# Altium schematic sheet 3d_dsn_approx - Copy.SchDoc
size A1; SheetNumber: 1; SheetTotal: 13
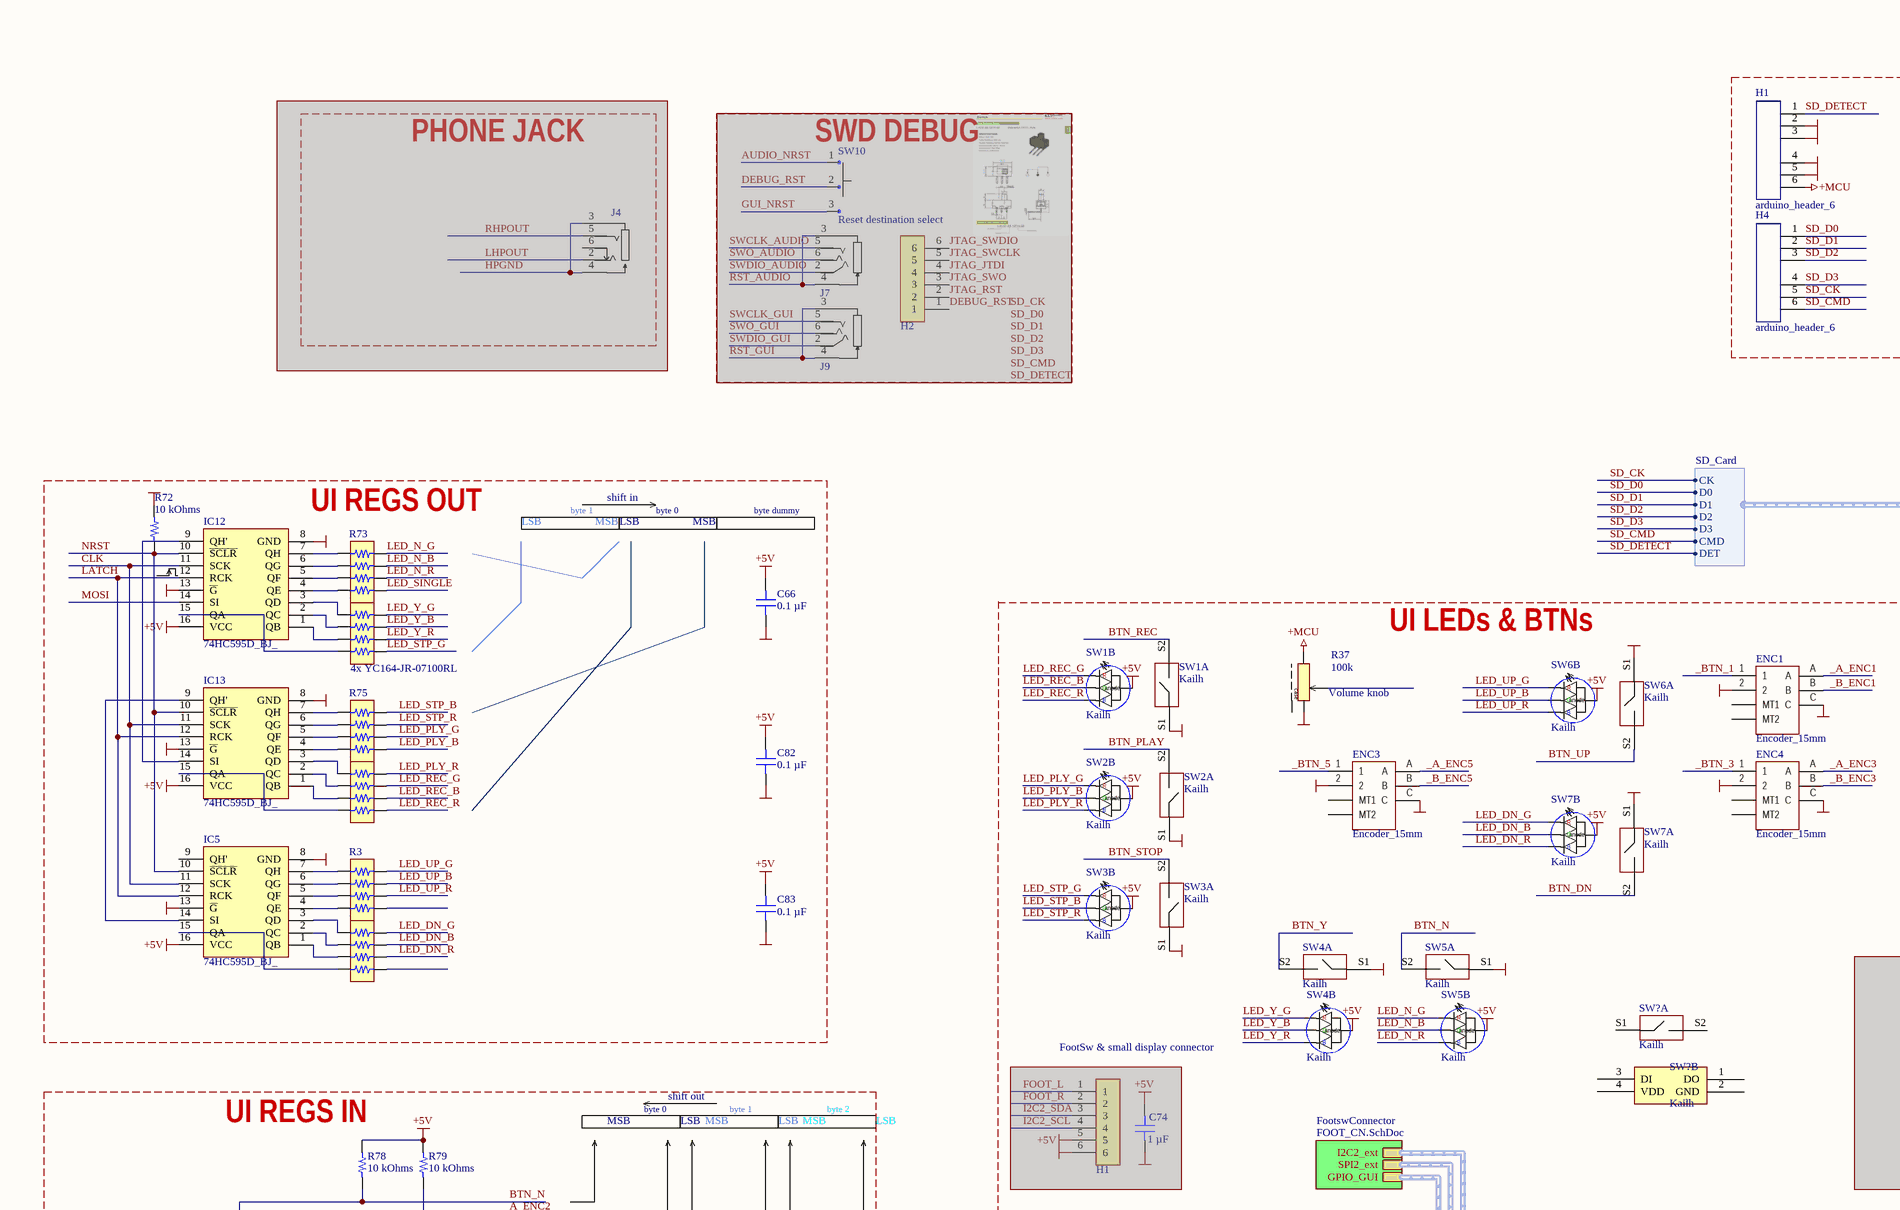
[diagram p0: 3d_dsn_approx - Copy.SchDoc, top left]
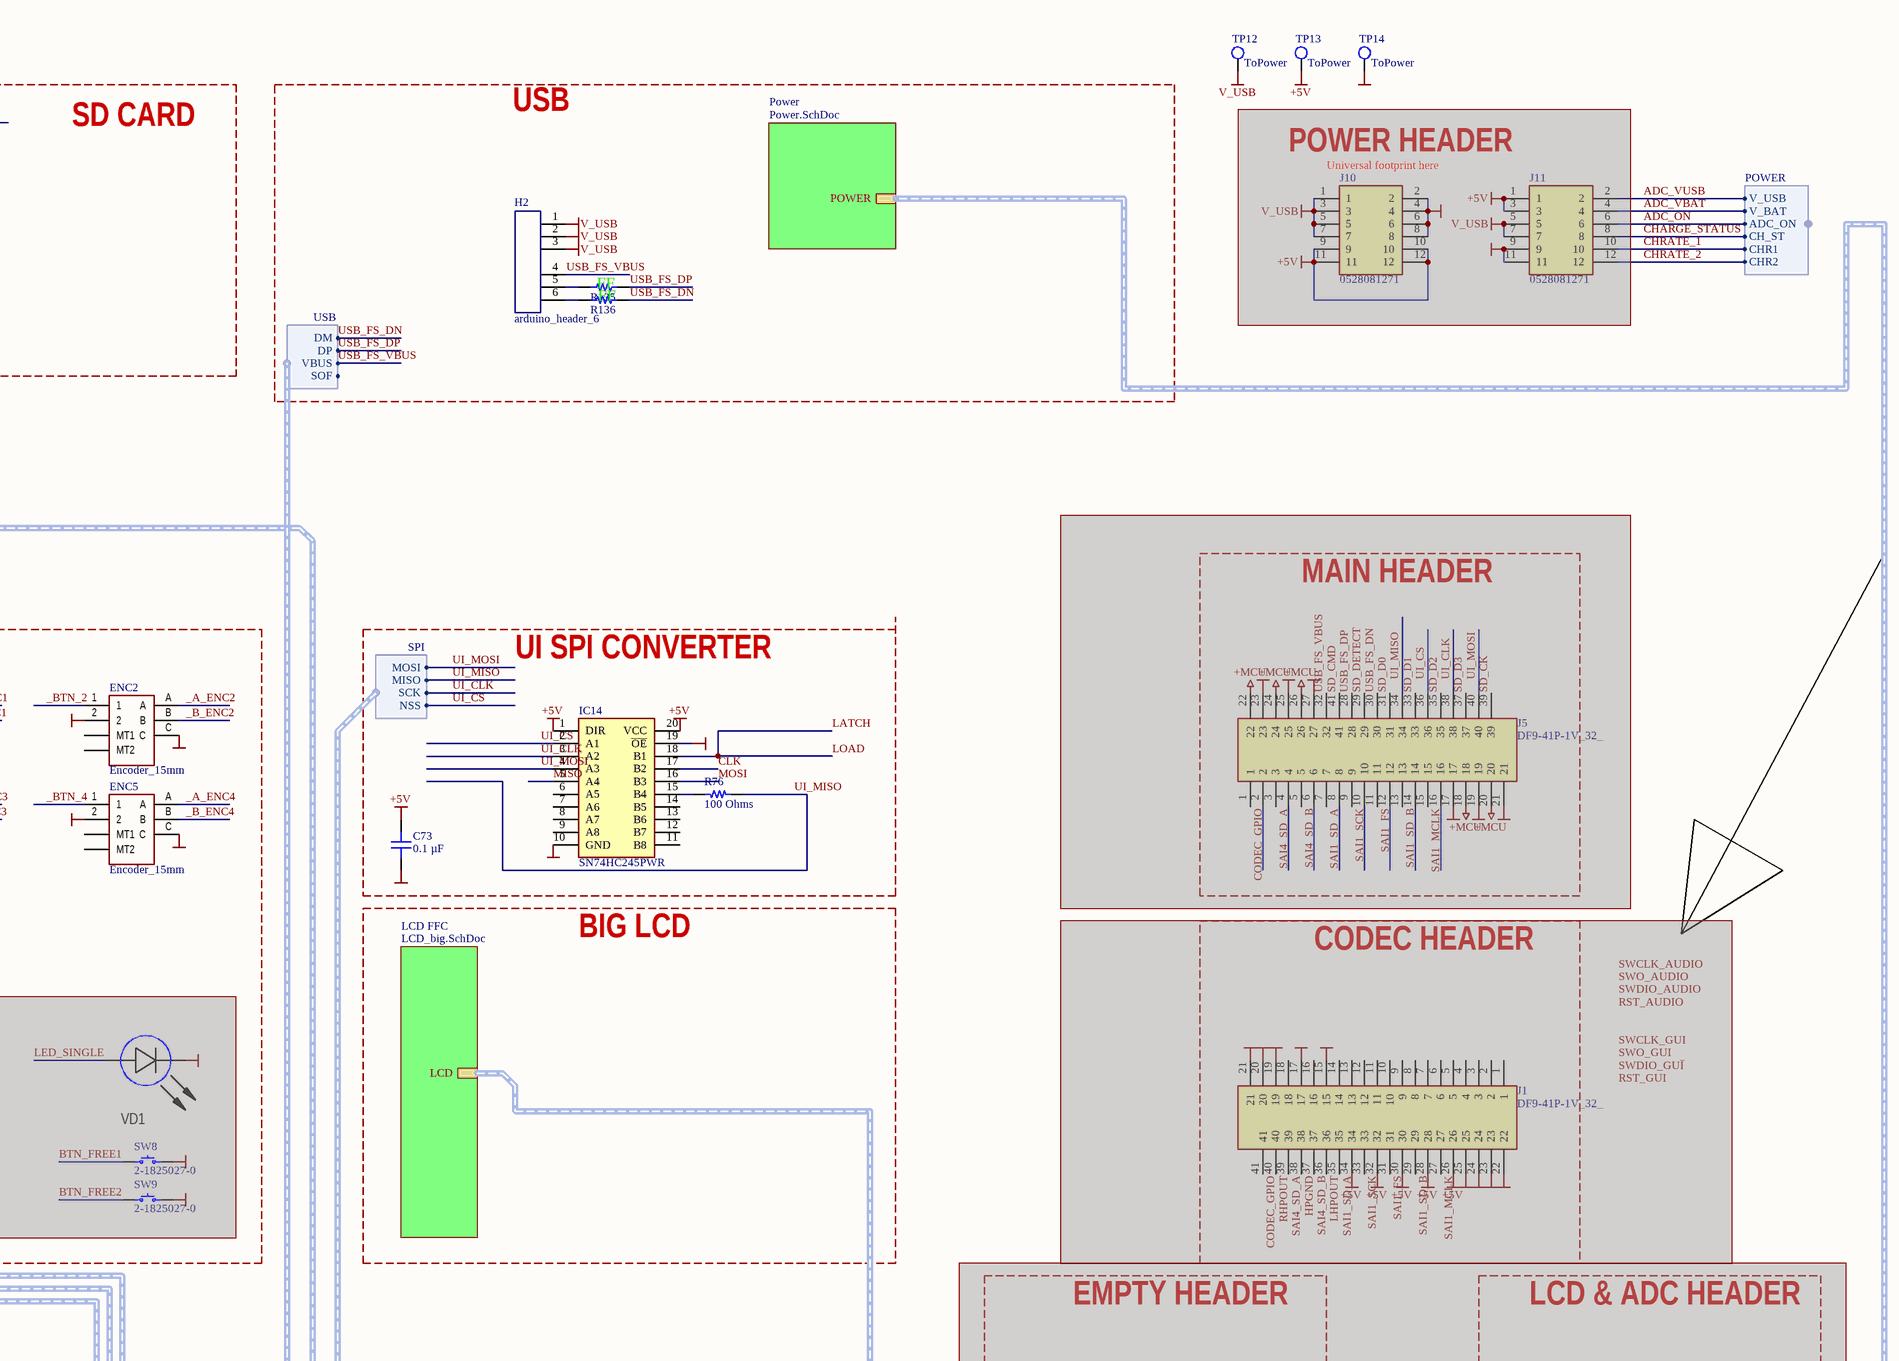
[diagram p1: 3d_dsn_approx - Copy.SchDoc, top right]
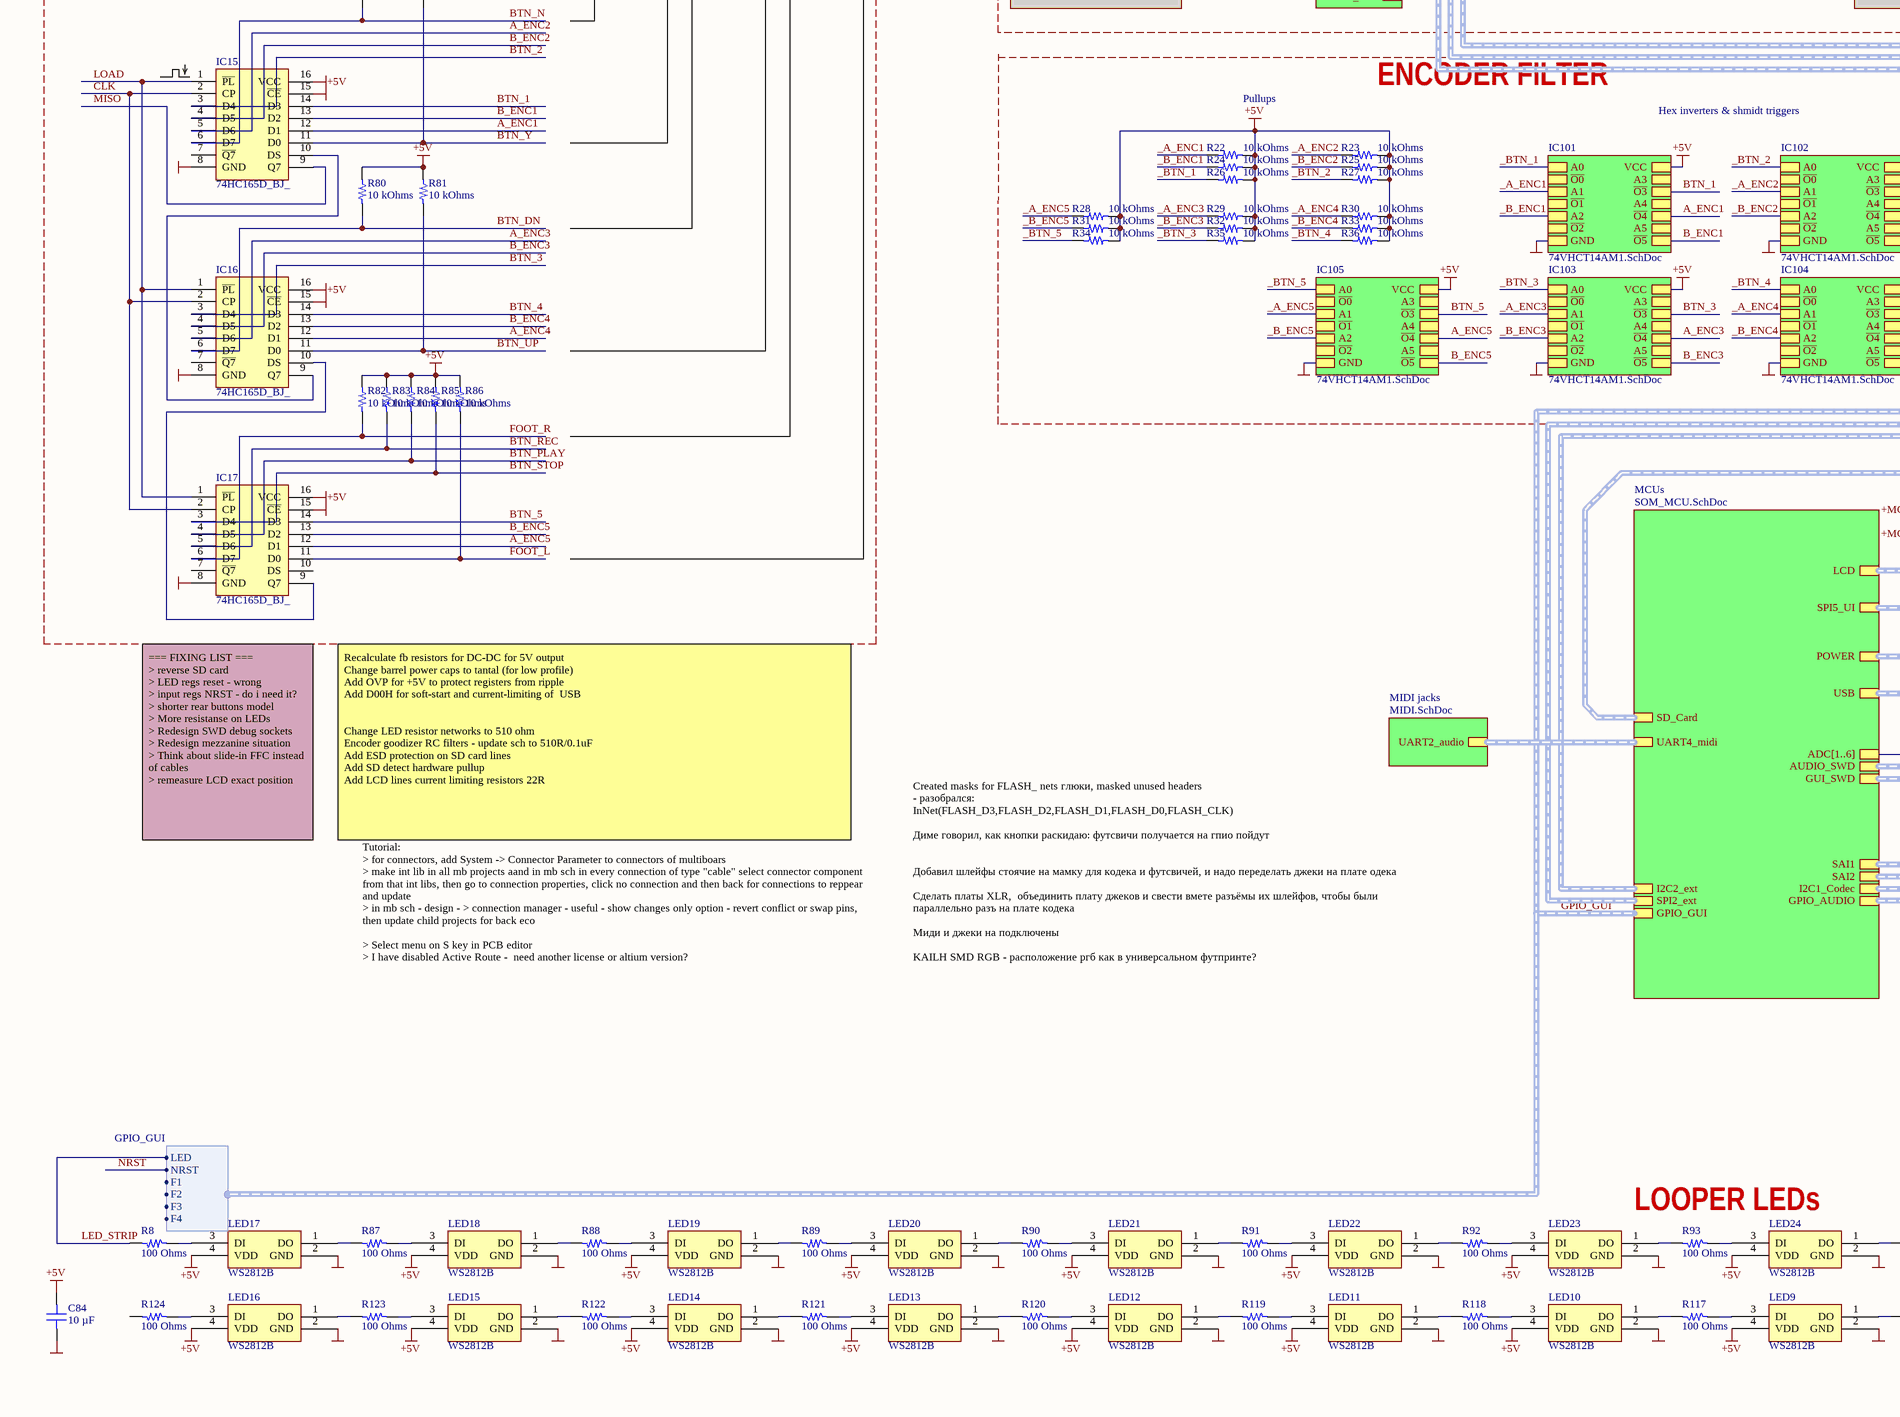
[diagram p2: 3d_dsn_approx - Copy.SchDoc, bottom left]
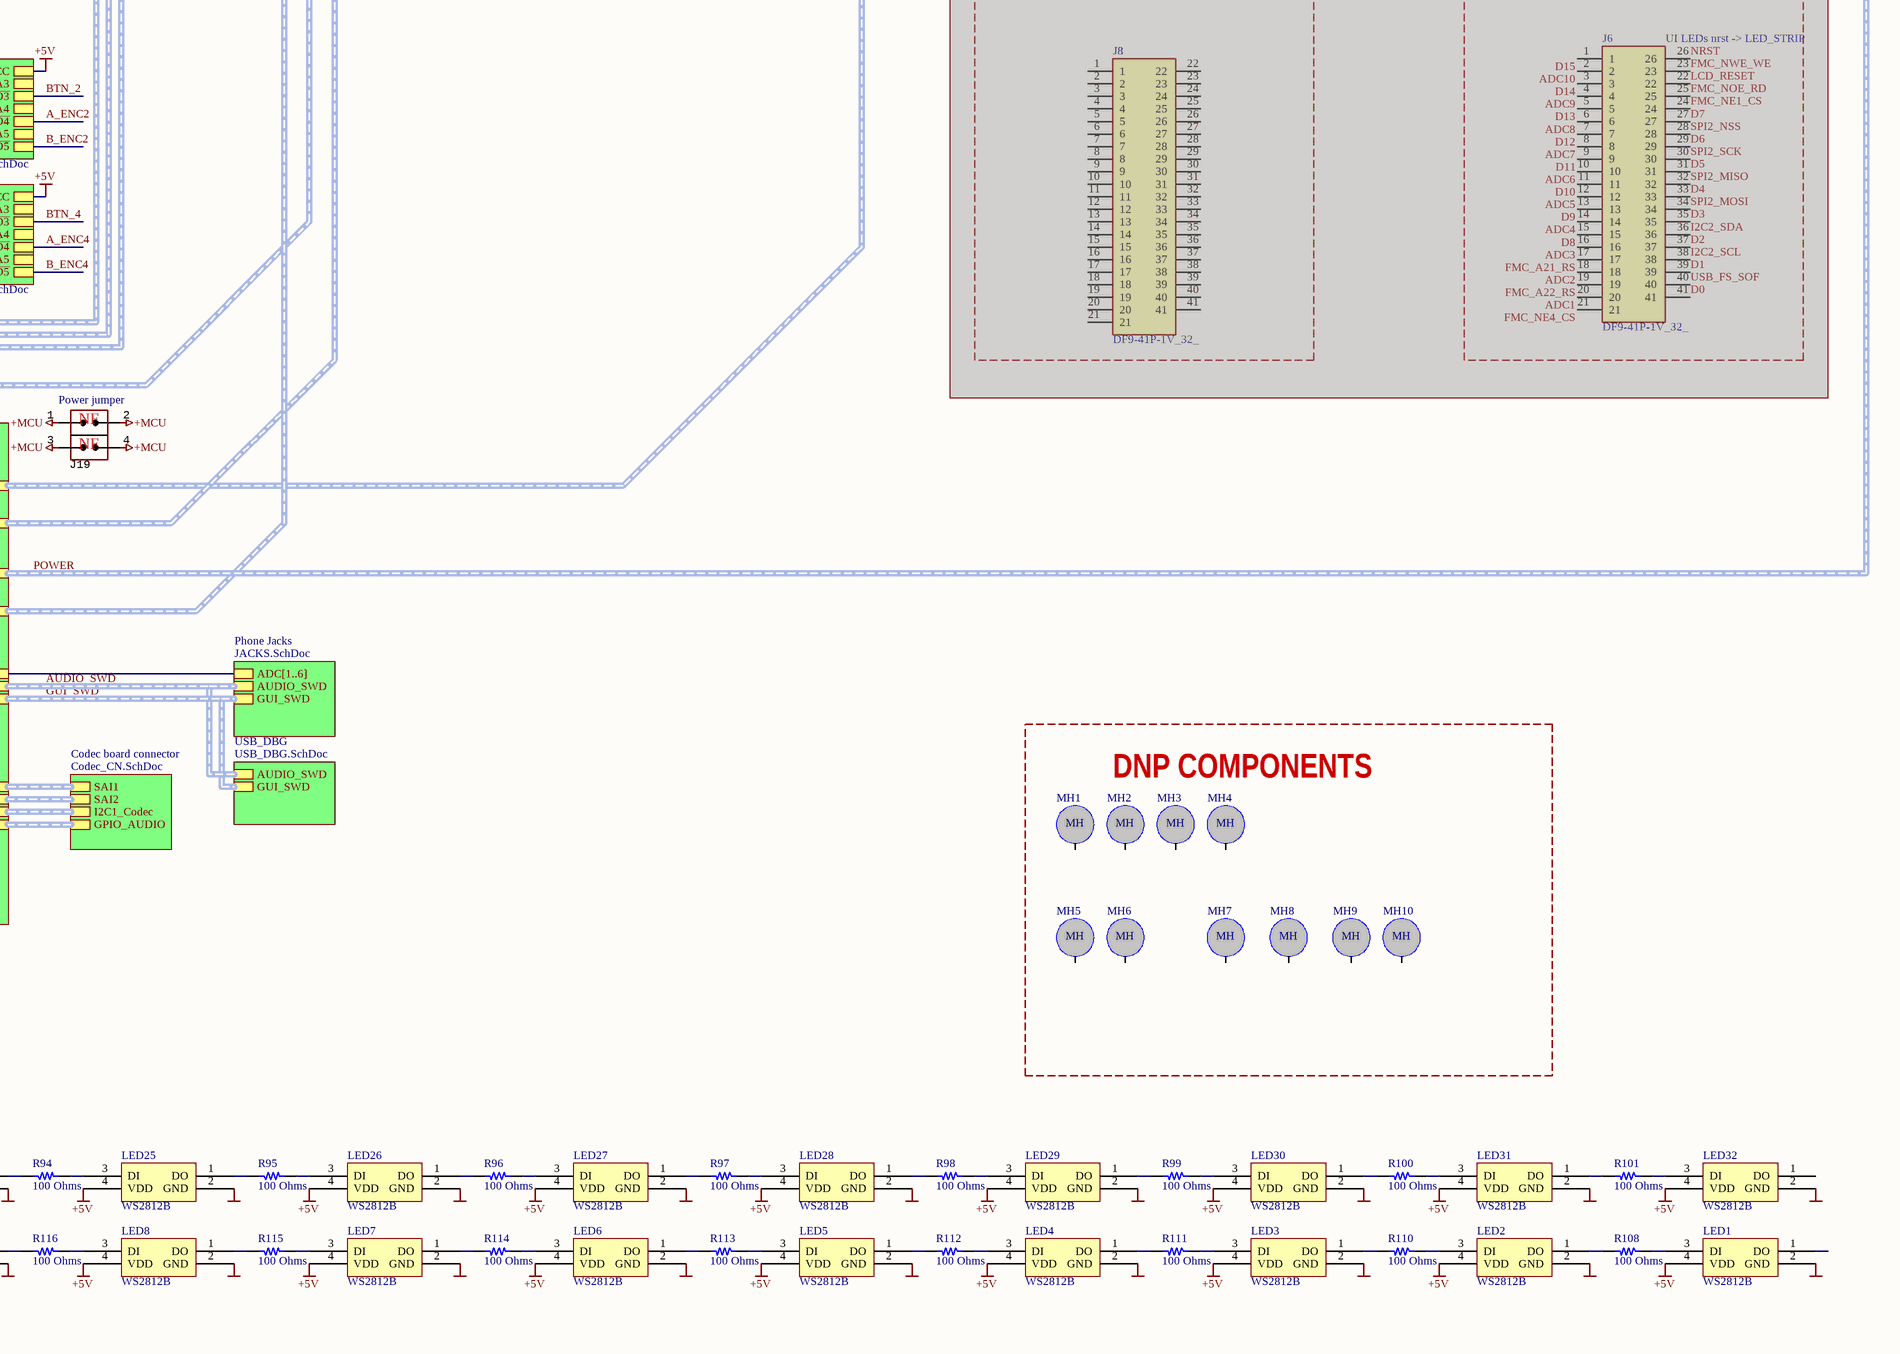
[diagram p3: 3d_dsn_approx - Copy.SchDoc, bottom right]

## Parts
(Parts that share a designator on the sheet are numbered #1, #2 ... from top to bottom, then left to right.)
C66  0.1 µF  [CAP 0603_1608]
C73  0.1 µF  [CAP 0603_1608]
C74  1 µF  [CAP 0805_2012]  (masked out: inside a compile mask, not in the netlist)
C82  0.1 µF  [CAP 0603_1608]
C83  0.1 µF  [CAP 0603_1608]
C84  10 µF  [CAP 0805_2012]
ENC1  Encoder_15mm  [EC11_15mm]
ENC2  Encoder_15mm  [EC11_15mm]
ENC3  Encoder_15mm  [EC11_15mm]
ENC4  Encoder_15mm  [EC11_15mm]
ENC5  Encoder_15mm  [EC11_15mm]
H1#1  arduino_header_6  [header-6_female]
H1#2  1.5-6A  [1.5-6A]  (value not drawn)  (masked out: inside a compile mask, not in the netlist)
H2#1  arduino_header_6  [header-6_female]
H2#2  1.5-6A  [1.5-6A]  (value not drawn)  (masked out: inside a compile mask, not in the netlist)
H4  arduino_header_6  [header-6_female]
IC5  74HC595D_BJ_  [SOIC127P600X175-16N]
IC12  74HC595D_BJ_  [SOIC127P600X175-16N]
IC13  74HC595D_BJ_  [SOIC127P600X175-16N]
IC14  SN74HC245PWR  [SOP65P640X120-20N]
IC15  74HC165D_BJ_  [SOIC127P600X175-16N]
IC16  74HC165D_BJ_  [SOIC127P600X175-16N]
IC17  74HC165D_BJ_  [SOIC127P600X175-16N]
J1  DF9-41P-1V_32_  [HIROSE_DF9-41P-1V(32)]  (masked out: inside a compile mask, not in the netlist)
J4  35RASMT2BHNTRX  [PJ_327]  (value not drawn)  (masked out: inside a compile mask, not in the netlist)
J5  DF9-41P-1V_32_  [HIROSE_DF9-41P-1V(32)]  (masked out: inside a compile mask, not in the netlist)
J6  DF9-41P-1V_32_  [HIROSE_DF9-41P-1V(32)]  (masked out: inside a compile mask, not in the netlist)
J7  PJ-327F  [PJ-327F]  (value not drawn)  (masked out: inside a compile mask, not in the netlist)
J8  DF9-41P-1V_32_  [HIROSE_DF9-41P-1V(32)]  (masked out: inside a compile mask, not in the netlist)
J9  PJ-327F  [PJ-327F]  (value not drawn)  (masked out: inside a compile mask, not in the netlist)
J10  0528081271  [AFA11-S12GLA-00]  (masked out: inside a compile mask, not in the netlist)
J11  0528081271  [AFA11-S12GLA-00]  (masked out: inside a compile mask, not in the netlist)
J19  (no value)  [CON: JUMPER x2]
LED1  WS2812B  [WS2812B_2.2x2mm]
LED2  WS2812B  [WS2812B_2.2x2mm]
LED3  WS2812B  [WS2812B_2.2x2mm]
LED4  WS2812B  [WS2812B_2.2x2mm]
LED5  WS2812B  [WS2812B_2.2x2mm]
LED6  WS2812B  [WS2812B_2.2x2mm]
LED7  WS2812B  [WS2812B_2.2x2mm]
LED8  WS2812B  [WS2812B_2.2x2mm]
LED9  WS2812B  [WS2812B_2.2x2mm]
LED10  WS2812B  [WS2812B_2.2x2mm]
LED11  WS2812B  [WS2812B_2.2x2mm]
LED12  WS2812B  [WS2812B_2.2x2mm]
LED13  WS2812B  [WS2812B_2.2x2mm]
LED14  WS2812B  [WS2812B_2.2x2mm]
LED15  WS2812B  [WS2812B_2.2x2mm]
LED16  WS2812B  [WS2812B_2.2x2mm]
LED17  WS2812B  [WS2812B_2.2x2mm]
LED18  WS2812B  [WS2812B_2.2x2mm]
LED19  WS2812B  [WS2812B_2.2x2mm]
LED20  WS2812B  [WS2812B_2.2x2mm]
LED21  WS2812B  [WS2812B_2.2x2mm]
LED22  WS2812B  [WS2812B_2.2x2mm]
LED23  WS2812B  [WS2812B_2.2x2mm]
LED24  WS2812B  [WS2812B_2.2x2mm]
LED25  WS2812B  [WS2812B_2.2x2mm]
LED26  WS2812B  [WS2812B_2.2x2mm]
LED27  WS2812B  [WS2812B_2.2x2mm]
LED28  WS2812B  [WS2812B_2.2x2mm]
LED29  WS2812B  [WS2812B_2.2x2mm]
LED30  WS2812B  [WS2812B_2.2x2mm]
LED31  WS2812B  [WS2812B_2.2x2mm]
LED32  WS2812B  [WS2812B_2.2x2mm]
MH1  MountingHole  [Hole_2.5mm]  (value not drawn)
MH2  MountingHole  [Hole_2.5mm]  (value not drawn)
MH3  MountingHole  [Hole_2.5mm]  (value not drawn)
MH4  MountingHole  [Hole_2.5mm]  (value not drawn)
MH5  MountingHole  [Hole_2.5mm]  (value not drawn)
MH6  MountingHole  [Hole_2.5mm]  (value not drawn)
MH7  MountingHole  [Hole_2.5mm]  (value not drawn)
MH8  MountingHole  [Hole_2.5mm]  (value not drawn)
MH9  MountingHole  [Hole_2.5mm]  (value not drawn)
MH10  MountingHole  [Hole_2.5mm]  (value not drawn)
R3  YC164-JR-07100RL  [RESNET 1206-8 CONVEX]  (value not drawn)
R4  YC164-JR-07100RL  [RESNET 1206-8 CONVEX]  (value not drawn)
R8  100 Ohms  [RES 0402_1005]
R22  10 kOhms  [RES 0603_1608]
R23  10 kOhms  [RES 0603_1608]
R24  10 kOhms  [RES 0603_1608]
R25  10 kOhms  [RES 0603_1608]
R26  10 kOhms  [RES 0603_1608]
R27  10 kOhms  [RES 0603_1608]
R28  10 kOhms  [RES 0603_1608]
R29  10 kOhms  [RES 0603_1608]
R30  10 kOhms  [RES 0603_1608]
R31  10 kOhms  [RES 0603_1608]
R32  10 kOhms  [RES 0603_1608]
R33  10 kOhms  [RES 0603_1608]
R34  10 kOhms  [RES 0603_1608]
R35  10 kOhms  [RES 0603_1608]
R36  10 kOhms  [RES 0603_1608]
R37  100k  [POT]
R72  10 kOhms  [RES 0603_1608]
R73  YC164-JR-07100RL  [RESNET 1206-8 CONVEX]  (value not drawn)
R74  YC164-JR-07100RL  [RESNET 1206-8 CONVEX]  (value not drawn)
R75  YC164-JR-07100RL  [RESNET 1206-8 CONVEX]  (value not drawn)
R76  100 Ohms  [RES 0402_1005]
R77  YC164-JR-07100RL  [RESNET 1206-8 CONVEX]  (value not drawn)
R78  10 kOhms  [RES 0603_1608]
R79  10 kOhms  [RES 0603_1608]
R80  10 kOhms  [RES 0603_1608]
R81  10 kOhms  [RES 0603_1608]
R82  10 kOhms  [RES 0603_1608]
R83  10 kOhms  [RES 0603_1608]
R84  10 kOhms  [RES 0603_1608]
R85  10 kOhms  [RES 0603_1608]
R86  10 kOhms  [RES 0603_1608]
R87  100 Ohms  [RES 0402_1005]
R88  100 Ohms  [RES 0402_1005]
R89  100 Ohms  [RES 0402_1005]
R90  100 Ohms  [RES 0402_1005]
R91  100 Ohms  [RES 0402_1005]
R92  100 Ohms  [RES 0402_1005]
R93  100 Ohms  [RES 0402_1005]
R94  100 Ohms  [RES 0402_1005]
R95  100 Ohms  [RES 0402_1005]
R96  100 Ohms  [RES 0402_1005]
R97  100 Ohms  [RES 0402_1005]
R98  100 Ohms  [RES 0402_1005]
R99  100 Ohms  [RES 0402_1005]
R100  100 Ohms  [RES 0402_1005]
R101  100 Ohms  [RES 0402_1005]
R108  100 Ohms  [RES 0402_1005]
R110  100 Ohms  [RES 0402_1005]
R111  100 Ohms  [RES 0402_1005]
R112  100 Ohms  [RES 0402_1005]
R113  100 Ohms  [RES 0402_1005]
R114  100 Ohms  [RES 0402_1005]
R115  100 Ohms  [RES 0402_1005]
R116  100 Ohms  [RES 0402_1005]
R117  100 Ohms  [RES 0402_1005]
R118  100 Ohms  [RES 0402_1005]
R119  100 Ohms  [RES 0402_1005]
R120  100 Ohms  [RES 0402_1005]
R121  100 Ohms  [RES 0402_1005]
R122  100 Ohms  [RES 0402_1005]
R123  100 Ohms  [RES 0402_1005]
R124  100 Ohms  [RES 0402_1005]
R135  (no value)  [RES 0603_1608]
R136  (no value)  [RES 0603_1608]
SW1  Kailh  [KAILH_UNI_MX_smdRGB]  (parts A,B of 2)
SW2  Kailh  [KAILH_UNI_MX_smdRGB]  (parts A,B of 2)
SW3  Kailh  [KAILH_UNI_MX_smdRGB]  (parts A,B of 2)
SW4  Kailh  [KAILH_UNI_MX_smdRGB]  (parts A,B of 2)
SW5  Kailh  [KAILH_UNI_MX_smdRGB]  (parts A,B of 2)
SW6  Kailh  [KAILH_UNI_MX_smdRGB]  (parts A,B of 2)
SW7  Kailh  [KAILH_UNI_MX_smdRGB]  (parts A,B of 2)
SW8  2-1825027-0  [TE 2-1825027-0]  (masked out: inside a compile mask, not in the netlist)
SW9  2-1825027-0  [TE 2-1825027-0]  (masked out: inside a compile mask, not in the netlist)
SW10  Reset destination select  [SLIDE_SW_BIG]  (masked out: inside a compile mask, not in the netlist)
SW?#1  Kailh  [KAILH_UNI_MX_WS2812]  (part A of 2)
SW?#2  Kailh  [KAILH_UNI_MX_WS2812]  (part B of 2)
TP12  ToPower  [TESTPOINT_PAD]
TP13  ToPower  [TESTPOINT_PAD]
TP14  ToPower  [TESTPOINT_PAD]
VD1  (no value)  [LED: 0805R]  (masked out: inside a compile mask, not in the netlist)

## Blocks framed on the sheet
SD CARD: H1#1 H4
USB: H2#1 R135 R136
PHONE JACK: J4
SWD DEBUG: H2#2 J7 J9 SW10
UI REGS OUT: C66 C82 C83 IC5 IC12 IC13 R3 R4 R72-R75 R77
MAIN HEADER: J5
UI LEDs & BTNs: C74 ENC1-ENC5 H1#2 R37 SW1-SW9 SW?#1 SW?#2 VD1
CODEC HEADER: J1
UI REGS IN: IC15-IC17 R78-R86
ENCODER FILTER: R22-R36
EMPTY HEADER: J8
LCD & ADC HEADER: J6
DNP COMPONENTS: MH1-MH10

## Sub-sheets
Codec board connector = Codec_CN.SchDoc: SAI1 (harness SAI), SAI2 (harness SAI), I2C1_Codec (harness I2C), GPIO_AUDIO (harness GPIO_AUDIO)
FootswConnector = FOOT_CN.SchDoc: I2C2_ext (harness I2C), SPI2_ext (harness SPI), GPIO_GUI (harness GPIO_GUI)
IC101 = 74VHCT14AM1.SchDoc: A0, ~{O0}, A1, ~{O1}, A2, ~{O2}, GND, VCC, A3, ~{O3}, A4, ~{O4}, A5, ~{O5}
IC102 = 74VHCT14AM1.SchDoc: A0, ~{O0}, A1, ~{O1}, A2, ~{O2}, GND, VCC, A3, ~{O3}, A4, ~{O4}, A5, ~{O5}
IC103 = 74VHCT14AM1.SchDoc: A0, ~{O0}, A1, ~{O1}, A2, ~{O2}, GND, VCC, A3, ~{O3}, A4, ~{O4}, A5, ~{O5}
IC104 = 74VHCT14AM1.SchDoc: A0, ~{O0}, A1, ~{O1}, A2, ~{O2}, GND, VCC, A3, ~{O3}, A4, ~{O4}, A5, ~{O5}
IC105 = 74VHCT14AM1.SchDoc: A0, ~{O0}, A1, ~{O1}, A2, ~{O2}, GND, VCC, A3, ~{O3}, A4, ~{O4}, A5, ~{O5}
LCD FFC = LCD_big.SchDoc: LCD (harness LCD)
MCUs = SOM_MCU.SchDoc: SD_Card (harness SD_Card), LCD (harness LCD), I2C2_ext (harness I2C), SPI2_ext (harness SPI), SPI5_UI (harness SPI), USB (harness USB), SAI1, SAI2, I2C1_Codec, GPIO_AUDIO, UART4_midi (harness SD_Card), GUI_SWD (harness SWD), AUDIO_SWD (harness SWD), GPIO_GUI (harness GPIO_GUI), ADC[1..6], POWER (harness POWER)
MIDI jacks = MIDI.SchDoc: UART2_audio (harness UART)
Phone Jacks = JACKS.SchDoc: GUI_SWD (harness SWD), AUDIO_SWD (harness SWD), ADC[1..6]
Power = Power.SchDoc: POWER (harness POWER)
USB_DBG = USB_DBG.SchDoc: GUI_SWD (harness SWD), AUDIO_SWD (harness SWD)

## Harnesses
SD_Card: CK, D0, D1, D2, D3, CMD, DET
SPI: MOSI, MISO, SCK, NSS
USB: DM, DP, VBUS, SOF
GPIO_GUI: LED, NRST, F1, F2, F3, F4
POWER: V_USB, V_BAT, ADC_ON, CH_ST, CHR1, CHR2

## Nets
+5V: C66.2 C73.2 C82.2 C83.2 C84.2 IC5.16(VCC) IC12.16(VCC) IC13.16(VCC) IC14.1(DIR) IC14.20(VCC) IC15.16(VCC) IC16.16(VCC) IC17.16(VCC) LED1.4(VDD) LED2.4(VDD) LED3.4(VDD) LED4.4(VDD) LED5.4(VDD) LED6.4(VDD) LED7.4(VDD) LED8.4(VDD) LED9.4(VDD) LED10.4(VDD) LED11.4(VDD) LED12.4(VDD) LED13.4(VDD) LED14.4(VDD) LED15.4(VDD) LED16.4(VDD) LED17.4(VDD) LED18.4(VDD) LED19.4(VDD) LED20.4(VDD) LED21.4(VDD) LED22.4(VDD) LED23.4(VDD) LED24.4(VDD) LED25.4(VDD) LED26.4(VDD) LED27.4(VDD) LED28.4(VDD) LED29.4(VDD) LED30.4(VDD) LED31.4(VDD) LED32.4(VDD) R22.2 R23.2 R24.2 R25.2 R26.2 R27.2 R28.2 R29.2 R30.2 R31.2 R32.2 R33.2 R34.2 R35.2 R36.2 R78.2 R79.2 R80.2 R81.2 R82.2 R83.2 R84.2 R85.2 R86.2 SW1.3(anode) SW2.3(anode) SW3.3(anode) SW4.3(anode) SW5.3(anode) SW6.3(anode) SW7.3(anode) TP13.1 ; sheet IC101/VCC, sheet IC102/VCC, sheet IC103/VCC, sheet IC104/VCC, sheet IC105/VCC
+MCU: H1#1.6 J19.1(IN) J19.2(IN) J19.3(IN) J19.4(IN) R37.1
GND: C66.1 C73.1 C82.1 C83.1 C84.1 ENC1.2 ENC1.C ENC2.2 ENC2.C ENC3.2 ENC3.C ENC4.2 ENC4.C ENC5.2 ENC5.C H1#1.2 H1#1.3 H1#1.4 H1#1.5 IC5.8(GND) IC5.13(~{G}) IC12.8(GND) IC12.13(~{G}) IC13.8(GND) IC13.13(~{G}) IC14.10(GND) IC14.19(~{OE}) IC15.8(GND) IC15.15(~{CE}) IC16.8(GND) IC16.15(~{CE}) IC17.8(GND) IC17.15(~{CE}) LED1.2(GND) LED2.2(GND) LED3.2(GND) LED4.2(GND) LED5.2(GND) LED6.2(GND) LED7.2(GND) LED8.2(GND) LED9.2(GND) LED10.2(GND) LED11.2(GND) LED12.2(GND) LED13.2(GND) LED14.2(GND) LED15.2(GND) LED16.2(GND) LED17.2(GND) LED18.2(GND) LED19.2(GND) LED20.2(GND) LED21.2(GND) LED22.2(GND) LED23.2(GND) LED24.2(GND) LED25.2(GND) LED26.2(GND) LED27.2(GND) LED28.2(GND) LED29.2(GND) LED30.2(GND) LED31.2(GND) LED32.2(GND) R37.3 R72.2 SW1.S1 SW2.S1 SW3.S1 SW4.S1 SW5.S1 SW6.S1 SW7.S1 TP14.1 ; sheet IC101/GND, sheet IC102/GND, sheet IC103/GND, sheet IC104/GND, sheet IC105/GND
V_USB: H2#1.1 H2#1.2 H2#1.3 TP12.1
_A_ENC1: ENC1.A R22.1 ; sheet IC101/A1
_A_ENC2: ENC2.A R23.1 ; sheet IC102/A1
_A_ENC3: ENC4.A R29.1 ; sheet IC103/A1
_A_ENC4: ENC5.A R30.1 ; sheet IC104/A1
_A_ENC5: ENC3.A R28.1 ; sheet IC105/A1
_B_ENC1: ENC1.B R24.1 ; sheet IC101/A2
_B_ENC2: ENC2.B R25.1 ; sheet IC102/A2
_B_ENC3: ENC4.B R32.1 ; sheet IC103/A2
_B_ENC4: ENC5.B R33.1 ; sheet IC104/A2
_B_ENC5: ENC3.B R31.1 ; sheet IC105/A2
_BTN_1: ENC1.1 R26.1 ; sheet IC101/A0
_BTN_2: ENC2.1 R27.1 ; sheet IC102/A0
_BTN_3: ENC4.1 R35.1 ; sheet IC103/A0
_BTN_4: ENC5.1 R36.1 ; sheet IC104/A0
_BTN_5: ENC3.1 R34.1 ; sheet IC105/A0
A_ENC1: IC15.12(D1) ; sheet IC101/~{O4}
A_ENC2: IC15.5(D6) ; sheet IC102/~{O4}
A_ENC3: IC16.5(D6) ; sheet IC103/~{O4}
A_ENC4: IC16.12(D1) ; sheet IC104/~{O4}
A_ENC5: IC17.12(D1) ; sheet IC105/~{O4}
ADC_ON: harness POWER.ADC_ON
ADC_VBAT: harness POWER.V_BAT
ADC_VUSB: harness POWER.V_USB
B_ENC1: IC15.13(D2) ; sheet IC101/~{O5}
B_ENC2: IC15.4(D5) ; sheet IC102/~{O5}
B_ENC3: IC16.4(D5) ; sheet IC103/~{O5}
B_ENC4: IC16.13(D2) ; sheet IC104/~{O5}
B_ENC5: IC17.13(D2) ; sheet IC105/~{O5}
BTN_1: IC15.14(D3) ; sheet IC101/~{O3}
BTN_2: IC15.3(D4) ; sheet IC102/~{O3}
BTN_3: IC16.3(D4) ; sheet IC103/~{O3}
BTN_4: IC16.14(D3) ; sheet IC104/~{O3}
BTN_5: IC17.14(D3) ; sheet IC105/~{O3}
BTN_DN: IC16.6(D7) R80.1 SW7.S2
BTN_N: IC15.6(D7) R78.1 SW5.S2
BTN_PLAY: IC17.4(D5) R84.1 SW2.S2
BTN_REC: IC17.5(D6) R83.1 SW1.S2
BTN_STOP: IC17.3(D4) R85.1 SW3.S2
BTN_UP: IC16.11(D0) R81.1 SW6.S2
BTN_Y: IC15.11(D0) R79.1 SW4.S2
CHARGE_STATUS: harness POWER.CH_ST
CHRATE_1: harness POWER.CHR1
CHRATE_2: harness POWER.CHR2
CLK: IC5.11(SCK) IC12.11(SCK) IC13.11(SCK) IC14.17(B2) IC15.2(CP) IC16.2(CP) IC17.2(CP)
FOOT_L: IC17.11(D0) R86.1
FOOT_R: IC17.6(D7) R82.1
LATCH: IC5.12(RCK) IC12.12(RCK) IC13.12(RCK) IC14.18(B1) IC15.1(~{PL}) IC16.1(~{PL}) IC17.1(~{PL})  [also labelled LOAD]
LED_DN_B: R4.3 SW7.2(G)
LED_DN_G: R4.4 SW7.1(R)
LED_DN_R: R4.2 SW7.4(B)
LED_N_B: R73.3 SW5.2(G)
LED_N_G: R73.4 SW5.1(R)
LED_N_R: R73.2 SW5.4(B)
LED_PLY_B: R75.1 SW2.2(G)
LED_PLY_G: R75.2 SW2.1(R)
LED_PLY_R: R77.4 SW2.4(B)
LED_REC_B: R77.2 SW1.2(G)
LED_REC_G: R77.3 SW1.1(R)
LED_REC_R: R77.1 SW1.4(B)
LED_SINGLE: R73.1
LED_STP_B: R75.4 SW3.2(G)
LED_STP_G: R74.1 SW3.1(R)
LED_STP_R: R75.3 SW3.4(B)
LED_STRIP: R8.2 ; sheet MCUs/GPIO_GUI.LED  [project net GPIO_GUI.LED]
LED_UP_B: R3.3 SW6.2(G)
LED_UP_G: R3.4 SW6.1(R)
LED_UP_R: R3.2 SW6.4(B)
LED_Y_B: R74.3 SW4.2(G)
LED_Y_G: R74.4 SW4.1(R)
LED_Y_R: R74.2 SW4.4(B)
MISO: IC14.5(A4) IC15.9(Q7)
MOSI: IC12.14(SI) IC14.16(B3)
NRST: IC5.10(~{SCLR}) IC12.10(~{SCLR}) IC13.10(~{SCLR}) R72.1 ; sheet MCUs/GPIO_GUI.NRST  [project net GPIO_GUI.NRST]
SD_CK: H4.5 ; sheet MCUs/SD_Card.CK
SD_CMD: H4.6 ; sheet MCUs/SD_Card.CMD
SD_D0: H4.1 ; sheet MCUs/SD_Card.D0
SD_D1: H4.2 ; sheet MCUs/SD_Card.D1
SD_D2: H4.3 ; sheet MCUs/SD_Card.D2
SD_D3: H4.4 ; sheet MCUs/SD_Card.D3
SD_DETECT: H1#1.1 ; sheet MCUs/SD_Card.DET
UI_CLK: IC14.3(A2) ; sheet MCUs/SPI5_UI.SCK
UI_CS: IC14.2(A1) ; sheet MCUs/SPI5_UI.NSS
UI_MISO: R76.1 ; sheet MCUs/SPI5_UI.MISO
UI_MOSI: IC14.4(A3) ; sheet MCUs/SPI5_UI.MOSI
USB_FS_DN: R136.1 ; sheet MCUs/USB.DM
USB_FS_DP: R135.1 ; sheet MCUs/USB.DP
USB_FS_VBUS: H2#1.4 ; sheet MCUs/USB.VBUS
NetH2#1_5: H2#1.5 R135.2
NetH2#1_6: H2#1.6 R136.2
NetIC5_1: IC5.1(QB) R4.7
NetIC5_2: IC5.2(QC) R4.6
NetIC5_3: IC5.3(QD) R4.5
NetIC5_4: IC5.4(QE) R3.8
NetIC5_5: IC5.5(QF) R3.7
NetIC5_6: IC5.6(QG) R3.6
NetIC5_7: IC5.7(QH) R3.5
NetIC5_14: IC5.14(SI) IC13.9(QH')
NetIC5_15: IC5.15(QA) R4.8
NetIC12_1: IC12.1(QB) R74.7
NetIC12_2: IC12.2(QC) R74.6
NetIC12_3: IC12.3(QD) R74.5
NetIC12_4: IC12.4(QE) R73.8
NetIC12_5: IC12.5(QF) R73.7
NetIC12_6: IC12.6(QG) R73.6
NetIC12_7: IC12.7(QH) R73.5
NetIC12_9: IC12.9(QH') IC13.14(SI)
NetIC12_15: IC12.15(QA) R74.8
NetIC13_1: IC13.1(QB) R77.7
NetIC13_2: IC13.2(QC) R77.6
NetIC13_3: IC13.3(QD) R77.5
NetIC13_4: IC13.4(QE) R75.8
NetIC13_5: IC13.5(QF) R75.7
NetIC13_6: IC13.6(QG) R75.6
NetIC13_7: IC13.7(QH) R75.5
NetIC13_15: IC13.15(QA) R77.8
NetIC14_15: IC14.15(B4) R76.2
NetIC15_10: IC15.10(DS) IC16.9(Q7)
NetIC16_10: IC16.10(DS) IC17.9(Q7)
NetLED1_3: LED1.3(DI) R108.1
NetLED2_1: LED2.1(DO) R108.2
NetLED2_3: LED2.3(DI) R110.1
NetLED3_1: LED3.1(DO) R110.2
NetLED3_3: LED3.3(DI) R111.1
NetLED4_1: LED4.1(DO) R111.2
NetLED4_3: LED4.3(DI) R112.1
NetLED5_1: LED5.1(DO) R112.2
NetLED5_3: LED5.3(DI) R113.1
NetLED6_1: LED6.1(DO) R113.2
NetLED6_3: LED6.3(DI) R114.1
NetLED7_1: LED7.1(DO) R114.2
NetLED7_3: LED7.3(DI) R115.1
NetLED8_1: LED8.1(DO) R115.2
NetLED8_3: LED8.3(DI) R116.1
NetLED9_1: LED9.1(DO) R116.2
NetLED9_3: LED9.3(DI) R117.1
NetLED10_1: LED10.1(DO) R117.2
NetLED10_3: LED10.3(DI) R118.1
NetLED11_1: LED11.1(DO) R118.2
NetLED11_3: LED11.3(DI) R119.1
NetLED12_1: LED12.1(DO) R119.2
NetLED12_3: LED12.3(DI) R120.1
NetLED13_1: LED13.1(DO) R120.2
NetLED13_3: LED13.3(DI) R121.1
NetLED14_1: LED14.1(DO) R121.2
NetLED14_3: LED14.3(DI) R122.1
NetLED15_1: LED15.1(DO) R122.2
NetLED15_3: LED15.3(DI) R123.1
NetLED16_1: LED16.1(DO) R123.2
NetLED16_3: LED16.3(DI) R124.1
NetLED17_1: LED17.1(DO) R87.2
NetLED17_3: LED17.3(DI) R8.1
NetLED18_1: LED18.1(DO) R88.2
NetLED18_3: LED18.3(DI) R87.1
NetLED19_1: LED19.1(DO) R89.2
NetLED19_3: LED19.3(DI) R88.1
NetLED20_1: LED20.1(DO) R90.2
NetLED20_3: LED20.3(DI) R89.1
NetLED21_1: LED21.1(DO) R91.2
NetLED21_3: LED21.3(DI) R90.1
NetLED22_1: LED22.1(DO) R92.2
NetLED22_3: LED22.3(DI) R91.1
NetLED23_1: LED23.1(DO) R93.2
NetLED23_3: LED23.3(DI) R92.1
NetLED24_1: LED24.1(DO) R94.2
NetLED24_3: LED24.3(DI) R93.1
NetLED25_1: LED25.1(DO) R95.2
NetLED25_3: LED25.3(DI) R94.1
NetLED26_1: LED26.1(DO) R96.2
NetLED26_3: LED26.3(DI) R95.1
NetLED27_1: LED27.1(DO) R97.2
NetLED27_3: LED27.3(DI) R96.1
NetLED28_1: LED28.1(DO) R98.2
NetLED28_3: LED28.3(DI) R97.1
NetLED29_1: LED29.1(DO) R99.2
NetLED29_3: LED29.3(DI) R98.1
NetLED30_1: LED30.1(DO) R100.2
NetLED30_3: LED30.3(DI) R99.1
NetLED31_1: LED31.1(DO) R101.2
NetLED31_3: LED31.3(DI) R100.1
NetLED32_3: LED32.3(DI) R101.1

Not connected (* = marked no-connect by the designer): ENC1 MT1 MT2; ENC2 MT1 MT2; ENC3 MT1 MT2; ENC4 MT1 MT2; ENC5 MT1 MT2; IC5 9(QH'); IC14 6(A5) 7(A6) 8(A7) 9(A8) 11(B8) 12(B7) 13(B6) 14(B5); IC15 7(~{Q7}); IC16 7(~{Q7}); IC17 7(~{Q7}) 10(DS); LED1 1(DO); LED32 1(DO); MH1 0; MH2 0; MH3 0; MH4 0; MH5 0; MH6 0; MH7 0; MH8 0; MH9 0; MH10 0; R3 1; R4 1; R37 2 4; R124 2; SW?#1 S1(1) S2(2); SW?#2 1(DO) 2(GND) 3(DI) 4(VDD)

## Buses and harness runs
bus sheet MCUs/ADC[1..6] = sheet Phone Jacks/ADC[1..6]
harness AUDIO_SWD = sheet MCUs/AUDIO_SWD = sheet Phone Jacks/AUDIO_SWD = sheet USB_DBG/AUDIO_SWD
harness GPIO_GUI = sheet FootswConnector/GPIO_GUI = sheet MCUs/GPIO_GUI
harness GUI_SWD = sheet MCUs/GUI_SWD = sheet Phone Jacks/GUI_SWD = sheet USB_DBG/GUI_SWD
harness POWER = sheet MCUs/POWER = sheet Power/POWER
harness sheet Codec board connector/GPIO_AUDIO = sheet MCUs/GPIO_AUDIO
harness sheet Codec board connector/I2C1_Codec = sheet MCUs/I2C1_Codec
harness sheet Codec board connector/SAI1 = sheet MCUs/SAI1
harness sheet Codec board connector/SAI2 = sheet MCUs/SAI2
harness sheet FootswConnector/I2C2_ext = sheet MCUs/I2C2_ext
harness sheet FootswConnector/SPI2_ext = sheet MCUs/SPI2_ext
harness sheet LCD FFC/LCD = sheet MCUs/LCD
harness sheet MCUs/UART4_midi = sheet MIDI jacks/UART2_audio

## Notes on the sheet
- POWER HEADER
- (near J10) Universal footprint here
- (near R135) FF
- FF
- shift in
- LSB
- byte 1
- MSB
- byte 0
- byte dummy
- (near R74) 4x YC164-JR-07100RL
- UI SPI CONVERTER
- (near R37) Volume knob
- BIG LCD
- (near H1#2) FootSw & small display connector
- shift out
- byte 2
- Pullups
- Hex inverters & shmidt triggers
- (near J6) UI LEDs nrst -> LED_STRIP
- (near J19) Power jumper
- (near J19) NF
- Recalculate fb resistors for DC-DC for 5V output
  Change barrel power caps to tantal (for low profile)
  Add OVP for +5V to protect registers from ripple
  Add D00H for soft-start and current-limiting of  USB
  Change LED resistor networks to 510 ohm
  Encoder goodizer RC filters - update sch to 510R/0.1uF
  Add ESD protection on SD card lines
  Add SD detect hardware pullup
  Add LCD lines current limiting resistors 22R
- Created masks for FLASH_ nets глюки, masked unused headers
  - разобрался:
  InNet(FLASH_D3,FLASH_D2,FLASH_D1,FLASH_D0,FLASH_CLK)
  Диме говорил, как кнопки раскидаю: футсвичи получается на гпио пойдут
  Добавил шлейфы стоячие на мамку для кодека и футсвичей, и надо переделать джеки на плате одека
  Сделать платы XLR,  объединить плату джеков и свести вмете разъёмы их шлейфов, чтобы были параллельно разъ на плате кодека
  Миди и джеки на подключены
  KAILH SMD RGB - расположение ргб как в универсальном футпринте?
- Tutorial:
  > for connectors, add System -> Connector Parameter to connectors of multiboars
  > make int lib in all mb projects aand in mb sch in every connection of type "cable" select connector component from that int libs, then go to connection properties, click no connection and then back for connections to reppear and update
  > in mb sch - design - > connection manager - useful - show changes only option - revert conflict or swap pins, then update child projects for back eco
  > Select menu on S key in PCB editor
  > I have disabled Active Route -  need another license or altium version?
- LOOPER LEDs
- (in symbol MountingHole) MH
- (in symbol POT 9MM 100K) case

## Library data of the parts
C66 C73 C82 C83 = C0603C104K5RAC7411: CAP CER 0.1UF 50V X7R 0603; manufacturer: KEMET; Tolerance: ±10%; Part Number: C0603C104K5RAC7411; Value: 0.1 µF; Applications: Bypass, Decoupling; Capacitance: 0.1 µF; componentlink1description: Datasheet; componentlink1url: https://api.kemet.com/component-edge/download/datasheet/C0603C104K5RAC7411.pdf; componentlink2description: DigiKey Link; componentlink2url: https://www.digikey.com/en/products/detail/kemet/C0603C104K5RAC7411/3317013; Device Package: 0603 (1608 Metric); lastupdated: 2/9/2024 8:10:30 PM; Lifecycle Status: Active; Minimum Order: 1; Mounting Type: Surface Mount, MLCC; Operating Temperature: -55°C ~ 125°C; Package / Case: 0603 (1608 Metric); packaging: TapeAndReel; partid: 2233; Part Status: Active; price: 0.01; series: SMD Comm X7R; Size / Dimension: 0.063" L x 0.031" W (1.60mm x 0.80mm); Supplier 1: DigiKey; Supplier Part Number 1: 399-C0603C104K5RAC7411CT-ND; Temperature Coefficient: X7R; Thickness (Max): 0.035" (0.90mm); Voltage - Rated: 50V
C74 = C0805C105K4RAC7800: CAP CER 1UF 16V X7R 0805; manufacturer: KEMET; Tolerance: ±10%; Part Number: C0805C105K4RAC7800; Value: 1 µF; Applications: Bypass, Decoupling; Capacitance: 1 µF; componentlink1description: Datasheet; componentlink1url: https://api.kemet.com/component-edge/download/datasheet/C0805C105K4RACTU.pdf; componentlink2description: DigiKey Link; componentlink2url: https://www.digikey.com/en/products/detail/kemet/C0805C105K4RAC7800/416047; Device Package: 0805 (2012 Metric); lastupdated: 9/19/2022 1:03:30 PM; Lifecycle Status: Active; Minimum Order: 1; Mounting Type: Surface Mount, MLCC; Operating Temperature: -55°C ~ 125°C; Package / Case: 0805 (2012 Metric); packaging: TapeAndReel; partid: 32075; Part Status: Active; price: 0.01; series: SMD Comm X7R; Size / Dimension: 0.079" L x 0.049" W (2.00mm x 1.25mm); Supplier 1: DigiKey; Supplier Part Number 1: 399-C0805C105K4RAC7800CT-ND; Temperature Coefficient: X7R; Thickness (Max): 0.039" (1.00mm); Voltage - Rated: 16V
C84 = C0805C106K8PAC7800: CAP CER 10UF 10V X5R 0805; manufacturer: KEMET; Tolerance: ±10%; Part Number: C0805C106K8PAC7800; Value: 10 µF; Applications: Bypass, Decoupling; Capacitance: 10 µF; componentlink1description: Datasheet; componentlink1url: https://connect.kemet.com:7667/gateway/IntelliData-ComponentDocumentation/1.0/download/datasheet/C0805C106K8PACTU; componentlink2description: DigiKey Link; componentlink2url: https://www.digikey.com/en/products/detail/kemet/C0805C106K8PAC7800/1090830; Device Package: 0805 (2012 Metric); lastupdated: 9/14/2022 7:51:56 AM; Lifecycle Status: Active; Minimum Order: 1; Mounting Type: Surface Mount, MLCC; Operating Temperature: -55°C ~ 85°C; Package / Case: 0805 (2012 Metric); packaging: TapeAndReel; partid: 44790; Part Status: Active; price: 0.02; series: SMD Comm X5R; Size / Dimension: 0.079" L x 0.049" W (2.00mm x 1.25mm); Supplier 1: DigiKey; Supplier Part Number 1: 399-C0805C106K8PAC7800CT-ND; Temperature Coefficient: X5R; Thickness (Max): 0.055" (1.40mm); Voltage - Rated: 10V
H1#2 H2#2 = 1.5-6A: Pin Header p=1.5mm, 6 pins
IC5 IC12 IC13 = 74HC595D_BJ_: Integrated Circuit; Manufacturer_Name: Toshiba; Manufacturer_Part_Number: 74HC595D(BJ); Datasheet Link: https://componentsearchengine.com/Datasheets/1/74HC595D(BJ).pdf; Height: 1.75mm; Mouser Part Number: 757-74HC595DBJ; Mouser Price/Stock: https://www.mouser.co.uk/ProductDetail/Toshiba/74HC595DBJ?qs=T%2FywbITssnTkqd02WdSNRg%3D%3D; Arrow Part Number: 74HC595D(BJ); Arrow Price/Stock: https://www.arrow.com/en/products/74hc595d-bj/toshiba?region=nac
IC14 = SN74HC245PWR: Integrated Circuit; Manufacturer_Name: Texas Instruments; Datasheet Link: http://www.ti.com/lit/gpn/sn74hc245; Height: 1.2mm; Manufacturer_Part_Number: SN74HC245PWR; Mouser Part Number: 595-SN74HC245PWR; Mouser Price/Stock: https://www.mouser.co.uk/ProductDetail/Texas-Instruments/SN74HC245PWR?qs=JS6RUWRH9DXHcWNikQOotA%3D%3D; Arrow Part Number: SN74HC245PWR; Arrow Price/Stock: https://www.arrow.com/en/products/sn74hc245pwr/texas-instruments?region=nac
IC15-IC17 = 74HC165D_BJ_: Integrated Circuit; Manufacturer_Name: Toshiba; Manufacturer_Part_Number: 74HC165D(BJ); Datasheet Link: https://www.arrow.com/en/products/74hc165d-bj/toshiba?region=nac; Height: 1.75mm; Mouser Part Number: 757-74HC165DBJ; Mouser Price/Stock: https://www.mouser.co.uk/ProductDetail/Toshiba/74HC165DBJ?qs=lQAVKuKFhkJom8fGze1o7Q%3D%3D; Arrow Part Number: 74HC165D(BJ); Arrow Price/Stock: https://www.arrow.com/en/products/74hc165d-bj/toshiba?region=nac
J1 J5 J6 J8 = DF9-41P-1V_32_: Connector; Manufacturer_Name: Hirose; Manufacturer_Part_Number: DF9-41P-1V(32); Datasheet Link: http://componentsearchengine.com/Datasheets/1/DF9-41P-1V(32).pdf; Mouser Part Number: 798-DF9-41P-1V32; Mouser Price/Stock: https://www.mouser.co.uk/ProductDetail/Hirose-Connector/DF9-41P-1V32?qs=zOgoZG1CgI%252BzVCgniEkwOw%3D%3D; Arrow Part Number: DF9-41P-1V(32); Arrow Price/Stock: https://www.arrow.com/en/products/df9-41p-1v-32/hirose-electric
J4 = 3.5mm jack stereo smd: Conn 3.5MM Stereo Jack F 3 POS Solder RA SMD 3 Terminal 1 Port T/R; MF: Switchcraft; MP: 35RASMT2BHNTRX; Package: None; Price: 0.84 USD; Availability: Good; SnapEDA_Link: https://www.snapeda.com/parts/35RASMT2BHNTRX/Switchcraft%20Inc./view-part/?ref=snap; Value: *
J7 J9 = 3.5mm jack 4pos smd: PJ-327F 4 contacts 5 pins 1 sw
J10 J11 = 0528081271: Connector; Manufacturer_Name: Molex; Datasheet Link: https://www.molex.com/pdm_docs/sd/528082071_sd.pdf; Height: 5.3mm; Manufacturer_Part_Number: 0528081271; System: Connector
J19 = Jumper_double: CommentText: "Перемычка"
LED1-LED32 = WS2812B: Address LED
R3 R4 R73-R75 R77 = YC164-JR-07100RL: RES ARRAY 4 RES 100 OHM 1206; Manufacturer: Yageo; Circuit Type: Isolated; Number of Resistors: 4; Power Per Element: 62.5mW; Resistance (Ohms): 100; Temperature Coefficient: ±200ppm/°C; Tolerance: ±5%; Part Number: YC164-JR-07100RL; Applications: DDRAM, SDRAM; ComponentLink1Description: Datasheet; ComponentLink1URL: https://www.yageo.com/upload/media/product/productsearch/datasheet/rchip/PYu-YC_TC_group_51_RoHS_L_9.pdf; ComponentLink2Description: DigiKey Link; ComponentLink2URL: http://digikey.com/product-detail/en/yageo/YC164-JR-07100RL/YC164J-100CT-ND/1005656; Height - Seated (Max): 0.028" (0.70mm); LastUpdated: 9/2/2020 1:23:24 AM; Lifecycle Status: Active; Minimum Order: 1; Mounting Type: Surface Mount; Number of Pins: 8; Operating Temperature: -55°C ~ 155°C; Package / Case: 1206 (3216 Metric), Convex, Long Side Terminals; Packaging: TapeAndReel; PartId: 239; Part Status: Active; Price: 0.01; Series: YC164; Size / Dimension: 0.126" L x 0.063" W (3.20mm x 1.60mm); Supplier 1: DigiKey; Supplier Part Number 1: YC164J-100CT-ND
R8 R76 R87-R101 R108 R110-R124 = CRCW0402100RFKEE: RES SMD 100 OHM 1% 1/16W 0402; Manufacturer: Vishay Dale; Power (Watts): 0.063W, 1/16W; Temperature Coefficient: ±100ppm/°C; Part Number: CRCW0402100RFKEE; Value: 100 Ohms; ComponentLink1Description: Datasheet; ComponentLink1URL: http://www.vishay.com/docs/20035/dcrcwe3.pdf; ComponentLink2Description: DigiKey Link; ComponentLink2URL: https://www.digikey.com/en/products/detail/vishay-dale/CRCW0402100RFKEE/5069886; Composition: Thick Film; Device Package: 0402 (1005 Metric); Height - Seated (Max): 0.016" (0.40mm); LastUpdated: 2/9/2024 8:30:05 PM; Lifecycle Status: Active; Minimum Order: 1; Number of Terminations: 2; Operating Temperature: -55°C ~ 155°C; Package / Case: 0402 (1005 Metric); Packaging: CutTape; PartId: 6830; Part Status: Active; Price: 0.01; Resistance: 100 Ohms; Series: CRCW; Size / Dimension: 0.039" L x 0.020" W (1.00mm x 0.50mm); Supplier 1: DigiKey; Supplier Part Number 1: 541-2953-1-ND; Supplier Device Package: 0402; Tolerance: ±1%; Features: Automotive AEC-Q200; Ratings: AEC-Q200
R22-R36 = ERJ-3EKF1002V: RES SMD 10K OHM 1% 1/10W 0603; Part Number: ERJ-3EKF1002V; Value: 10 kOhms
R37 = POT 9MM 100K
R72 R78-R86 = ERJ-3EKF1002V: RES SMD 10K OHM 1% 1/10W 0603; Manufacturer: Panasonic Electronic Components; Power (Watts): 0.1W, 1/10W; Temperature Coefficient: ±100ppm/°C; Part Number: ERJ-3EKF1002V; Value: 10 kOhms; ComponentLink1Description: Datasheet; ComponentLink1URL: https://industrial.panasonic.com/cdbs/www-data/pdf/RDA0000/AOA0000C304.pdf; ComponentLink2Description: DigiKey Link; ComponentLink2URL: https://www.digikey.com/en/products/detail/panasonic-electronic-components/ERJ-3EKF1002V/196066; Composition: Thick Film; Device Package: 0603 (1608 Metric); Height - Seated (Max): 0.022" (0.55mm); LastUpdated: 2/9/2024 8:41:59 PM; Lifecycle Status: Active; Minimum Order: 1; Number of Terminations: 2; Operating Temperature: -55°C ~ 155°C; Package / Case: 0603 (1608 Metric); Packaging: TapeAndReel; PartId: 25695; Part Status: Active; Price: 0.01; Resistance: 10 kOhms; Series: ERJ-3EK; Size / Dimension: 0.063" L x 0.031" W (1.60mm x 0.80mm); Supplier 1: DigiKey; Supplier Part Number 1: P10.0KHCT-ND; Supplier Device Package: 0603; Tolerance: ±1%; Features: Automotive AEC-Q200; Ratings: AEC-Q200
R135 R136 = RCA06030000ZSEA: RES SMD 0 OHM JUMPER 1/10W 0603; Manufacturer: Vishay Dale; Power (Watts): 0.1W, 1/10W; Part Number: RCA06030000ZSEA; ComponentLink1Description: Datasheet; ComponentLink1URL: http://www.vishay.com/docs/20037/rcae3.pdf; ComponentLink2Description: DigiKey Link; ComponentLink2URL: http://digikey.com/product-detail/en/vishay-dale/RCA06030000ZSEA/541-2192-1-ND/4946845; Composition: Thick Film; Device Package: 0603 (1608 Metric); Features: Anti-Sulfur, Automotive AEC-Q200; Height - Seated (Max): 0.020" (0.50mm); LastUpdated: 9/2/2020 1:10:23 AM; Lifecycle Status: Active; Minimum Order: 1; Number of Terminations: 2; Operating Temperature: -55°C ~ 155°C; Package / Case: 0603 (1608 Metric); Packaging: TapeAndReel; PartId: 5740; Part Status: Active; Price: 0.01; Ratings: AEC-Q200; Series: RCA; Size / Dimension: 0.061" L x 0.033" W (1.55mm x 0.85mm); Supplier 1: DigiKey; Supplier Part Number 1: 541-2192-1-ND; Supplier Device Package: 0603; Tolerance: Jumper
SW1-SW7 = Kailh_hotswap_RGB_SMD: Kailh keyboard switch, hotswap rgb, dual-side hotswap options + low prifile variant
SW8 SW9 = 2-1825027-0: SWITCH TACTILE SPST-NO 0.05A 24V; Manufacturer: TE Connectivity ALCOSWITCH Switches; Actuator Length, Right Angle: 11.85mm; Actuator Orientation: Side Actuated; Actuator Type: Standard; Contact Rating @ Voltage: 0.05A @ 24VDC; Illumination: Non-Illuminated; Operating Force: 160gf; Outline: 7.11mm x 6.60mm; Switch Function: Off-Mom; Part Number: 2-1825027-0; Circuit: SPST-NO; ComponentLink1Description: Datasheet; ComponentLink1URL: https://www.te.com/commerce/DocumentDelivery/DDEController?Action=srchrtrv&DocNm=1308111-1_SWITCHES_CORE_PROGRAM_CATALOG&DocType=CS&DocLang=English; ComponentLink2Description: DigiKey Link; ComponentLink2URL: http://digikey.com/product-detail/en/te-connectivity-alcoswitch-switches/2-1825027-0/450-1661-ND/1632547; LastUpdated: 9/6/2020 11:08:27 AM; Lifecycle Status: Active; Minimum Order: 1; Mounting Type: Through Hole, Right Angle; Operating Temperature: -35°C ~ 85°C; Packaging: Bulk; Part Status: Active; Price: 0.22; Series: FSMRAJ; Supplier 1: DigiKey; Supplier Part Number 1: 450-1661-ND; Termination Style: PC Pin
SW10 = RockerSwitch_3mm: Slide switch L-KLS7-SS-12F19-G5
SW?#1 SW?#2 = Kailh_hotswap_WS2812: Kailh keyboard switch, hotswap rgb, dual-side hotswap options + low prifile variant
TP12-TP14 = TestPoint
VD1 = LED_single: ValueManufacturerPartNumber: LED, Green, *, *, *, -55...+150°C; TypeDiode: LED; ColorParameter: Green; Manufacturer: *; Package: *; HelpURL: *; Temperature: -55...+150°C; Current: *; VoltageDrop: *; PartNumber: *; Color: GREEN; Supplier 1: LCSC; Supplier Part Number 1: C919445